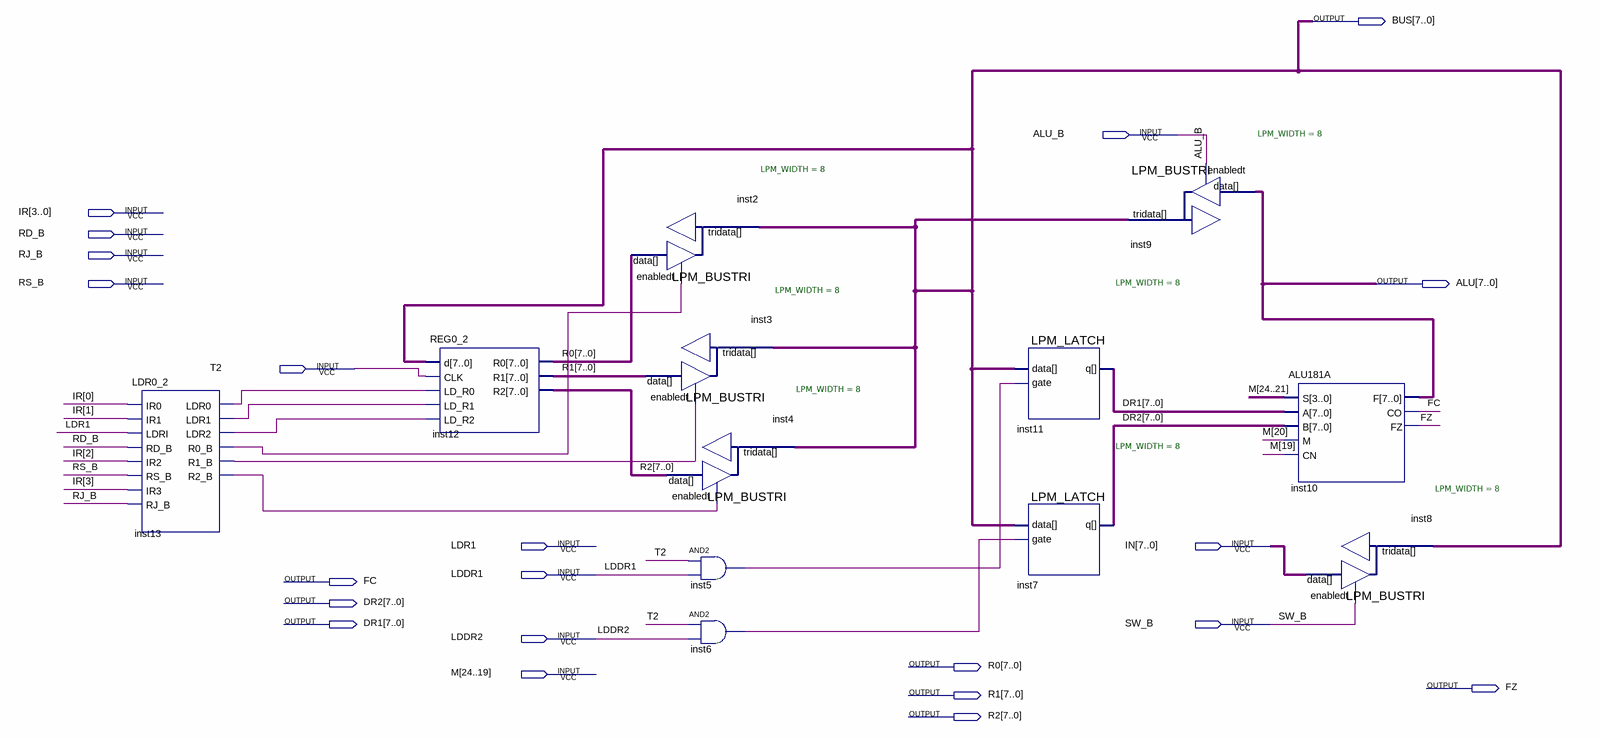
[diagram p0: schematic sheet]
// Quartus schematic ALU_MD.bdf as structural Verilog: 12 symbols, 21 pins
module ALU_MD (
  input  ALU_B,
  input  [3:0] IR,
  input  RD_B,
  input  RJ_B,
  input  RS_B,
  input  T2,
  input  LDR1,
  input  [7:0] IN,
  input  LDDR1,
  input  SW_B,
  input  LDDR2,
  input  [24:19] M,
  output [7:0] BUS,
  output [7:0] ALU,
  output FC,
  output [7:0] DR2,
  output [7:0] DR1,
  output [7:0] R0,
  output FZ,
  output [7:0] R1,
  output [7:0] R2
);

  wire inst5_out, inst6_out, inst13_ldr0, inst13_ldr1, inst13_ldr2, inst13_r0_b, inst13_r1_b, inst13_r2_b;

  LDR0_2 inst13 (
    .IR0(IR[0]), .IR1(IR[1]), .LDRI(LDR1), .RD_B(RD_B), .IR2(IR[2]), .RS_B(RS_B), .IR3(IR[3]), .RJ_B(RJ_B),
    .LDR0(inst13_ldr0), .LDR1(inst13_ldr1), .LDR2(inst13_ldr2), .R0_B(inst13_r0_b), .R1_B(inst13_r1_b),
    .R2_B(inst13_r2_b));
  REG0_2 inst12 (
    .d(BUS), .CLK(T2), .LD_R0(inst13_ldr0), .LD_R1(inst13_ldr1), .LD_R2(inst13_ldr2), .R0(R0), .R1(R1),
    .R2(R2));
  LPM_BUSTRI #(.LPM_WIDTH(8)) inst2 (.data(R0), .enabledt(inst13_r0_b), .tridata(BUS));
  LPM_BUSTRI #(.LPM_WIDTH(8)) inst3 (.data(R1), .enabledt(inst13_r1_b), .tridata(BUS));
  LPM_BUSTRI #(.LPM_WIDTH(8)) inst4 (.data(R2), .enabledt(inst13_r2_b), .tridata(BUS));
  and inst5 (inst5_out, T2, LDDR1);
  and inst6 (inst6_out, T2, LDDR2);
  LPM_LATCH #(.LPM_WIDTH(8)) inst11 (.data(BUS), .gate(inst5_out), .q(DR1));
  LPM_LATCH #(.LPM_WIDTH(8)) inst7 (.data(BUS), .gate(inst6_out), .q(DR2));
  LPM_BUSTRI #(.LPM_WIDTH(8)) inst9 (.data(ALU), .enabledt(ALU_B), .tridata(BUS));
  ALU181A inst10 (.S(M[24:21]), .A(DR1), .B(DR2), .M(M[20]), .CN(M[19]), .F(ALU), .CO(FC), .FZ(FZ));
  LPM_BUSTRI #(.LPM_WIDTH(8)) inst8 (.data(IN), .enabledt(SW_B), .tridata(BUS));
endmodule
